# EAGLE design Switching (EAGLE 7.2.0)
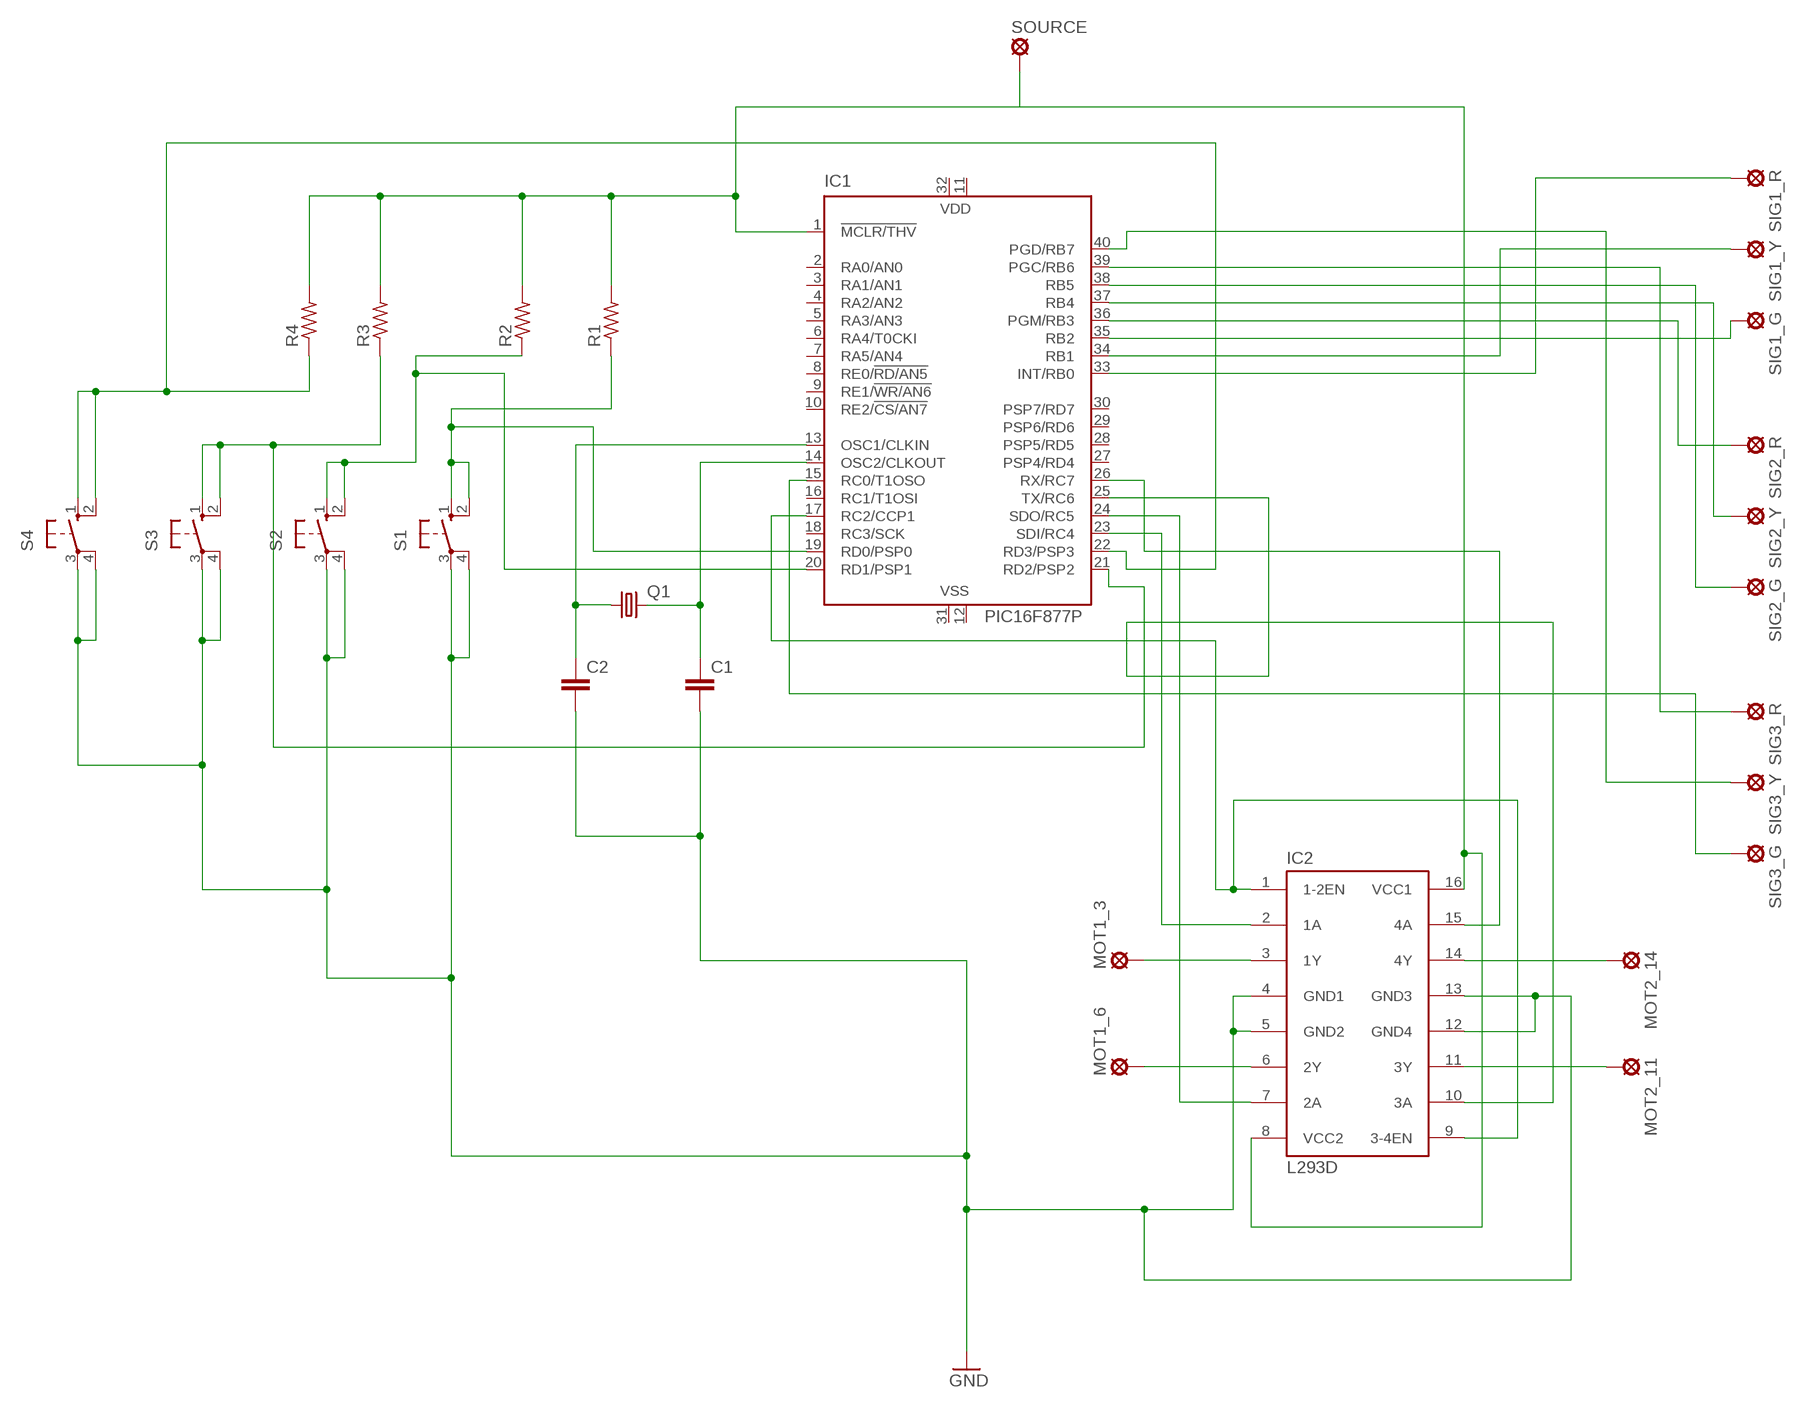
[diagram p0: schematic, sheet 1]

## Parts
C1  C-EU025-025X050  [C025-025X050]
C2  C-EU025-025X050  [C025-025X050]
IC1  PIC16F877P  [DIL40]
IC2  L293D  [DIL16]
MOT1_3  LSP10  [LSP10]
MOT1_6  LSP10  [LSP10]
MOT2_11  LSP10  [LSP10]
MOT2_14  LSP10  [LSP10]
Q1  CRYSTALHC49U70  [HC49U70]
R1  R-US_0207/10  [0207/10]
R2  R-US_0207/10  [0207/10]
R3  R-US_0207/10  [0207/10]
R4  R-US_0207/10  [0207/10]
S1  10-XX  [B3F-10XX]
S2  10-XX  [B3F-10XX]
S3  10-XX  [B3F-10XX]
S4  10-XX  [B3F-10XX]
SIG1_G  LSP10  [LSP10]
SIG1_R  LSP10  [LSP10]
SIG1_Y  LSP10  [LSP10]
SIG2_G  LSP10  [LSP10]
SIG2_R  LSP10  [LSP10]
SIG2_Y  LSP10  [LSP10]
SIG3_G  LSP10  [LSP10]
SIG3_R  LSP10  [LSP10]
SIG3_Y  LSP10  [LSP10]
SOURCE  LSP10  [LSP10]

## Nets
GND: C1.2 C2.2 IC2.4(GND1) IC2.5(GND2) IC2.12(GND4) IC2.13(GND3) S1.3(P) S1.4(P1) S2.3(P) S2.4(P1) S3.3(P) S3.4(P1) S4.3(P) S4.4(P1)
N$1: IC1.33(INT/RB0) SIG1_R.MP
N$2: IC1.34(RB1) SIG1_Y.MP
N$3: IC1.35(RB2) SIG1_G.MP
N$4: IC1.36(PGM/RB3) SIG2_R.MP
N$5: IC1.37(RB4) SIG2_Y.MP
N$6: IC1.38(RB5) SIG2_G.MP
N$7: IC1.39(PGC/RB6) SIG3_R.MP
N$8: IC1.40(PGD/RB7) SIG3_Y.MP
N$9: IC1.15(RC0/T1OSO) SIG3_G.MP
N$10: IC1.17(RC2/CCP1) IC2.1(1-2EN) IC2.9(3-4EN)
N$12: IC1.25(TX/RC6) IC2.10(3A)
N$13: IC1.26(RX/RC7) IC2.15(4A)
N$14: IC1.23(SDI/RC4) IC2.2(1A)
N$15: IC1.24(SDO/RC5) IC2.7(2A)
N$16: IC1.1(!MCLR/THV) IC2.8(VCC2) IC2.16(VCC1) R1.2 R2.2 R3.2 R4.2 SOURCE.MP
N$19: IC2.3(1Y) MOT1_3.MP
N$20: IC2.6(2Y) MOT1_6.MP
N$21: IC2.14(4Y) MOT2_14.MP
N$22: IC2.11(3Y) MOT2_11.MP
N$23: C2.1 IC1.13(OSC1/CLKIN) Q1.1
N$24: C1.1 IC1.14(OSC2/CLKOUT) Q1.2
N$27: IC1.19(RD0/PSP0) R1.1 S1.1(S) S1.2(S1)
N$29: IC1.20(RD1/PSP1) R2.1 S2.1(S) S2.2(S1)
N$30: IC1.21(RD2/PSP2) R3.1 S3.1(S) S3.2(S1)
N$31: IC1.22(RD3/PSP3) R4.1 S4.1(S) S4.2(S1)
Unconnected: IC1.2(RA0/AN0) IC1.3(RA1/AN1) IC1.4(RA2/AN2) IC1.5(RA3/AN3) IC1.6(RA4/T0CKI) IC1.7(RA5/AN4) IC1.8(RE0/!RD/AN5) IC1.9(RE1/!WR/AN6) IC1.10(RE2/!CS/AN7) IC1.16(RC1/T1OSI) IC1.18(RC3/SCK) IC1.27(PSP4/RD4) IC1.28(PSP5/RD5) IC1.29(PSP6/RD6) IC1.30(PSP7/RD7)

## Power pins joined to a net without a drawn wire
VDD: IC1.11(VDD) IC1.32(VDD)
VSS: IC1.12(VSS) IC1.31(VSS)

## Library data of the parts
C1 C2 = rcl:C-EU: CAPACITOR, European symbol
IC1 = microchip:PIC16F87*: MICROCONTROLLER; MF: MICROCHIP; MPN: PIC16F877-04/P; OC_FARNELL: 9761349; OC_NEWARK: 61K3463
IC2 = st-microelectronics:L293D: PUSH-PULL 4 CHANNEL DRIVER; MPN: L293D; OC_FARNELL: 9589619; OC_NEWARK: 56P8249
MOT1_3 MOT1_6 MOT2_11 MOT2_14 SIG1_G SIG1_R SIG1_Y SIG2_G SIG2_R SIG2_Y SIG3_G SIG3_R SIG3_Y SOURCE = solpad:LSP10: SOLDER PAD drill 1.0 mm, distributor Buerklin, 12H555
Q1 = crystal:CRYSTAL: CRYSTAL; OC_FARNELL: unknown; OC_NEWARK: unknown
R1-R4 = rcl:R-US_: RESISTOR, American symbol
S1-S4 = switch-omron:10-XX: OMRON SWITCH; MPN: B3F-1000; OC_FARNELL: 176432; OC_NEWARK: 36M3542

## Board
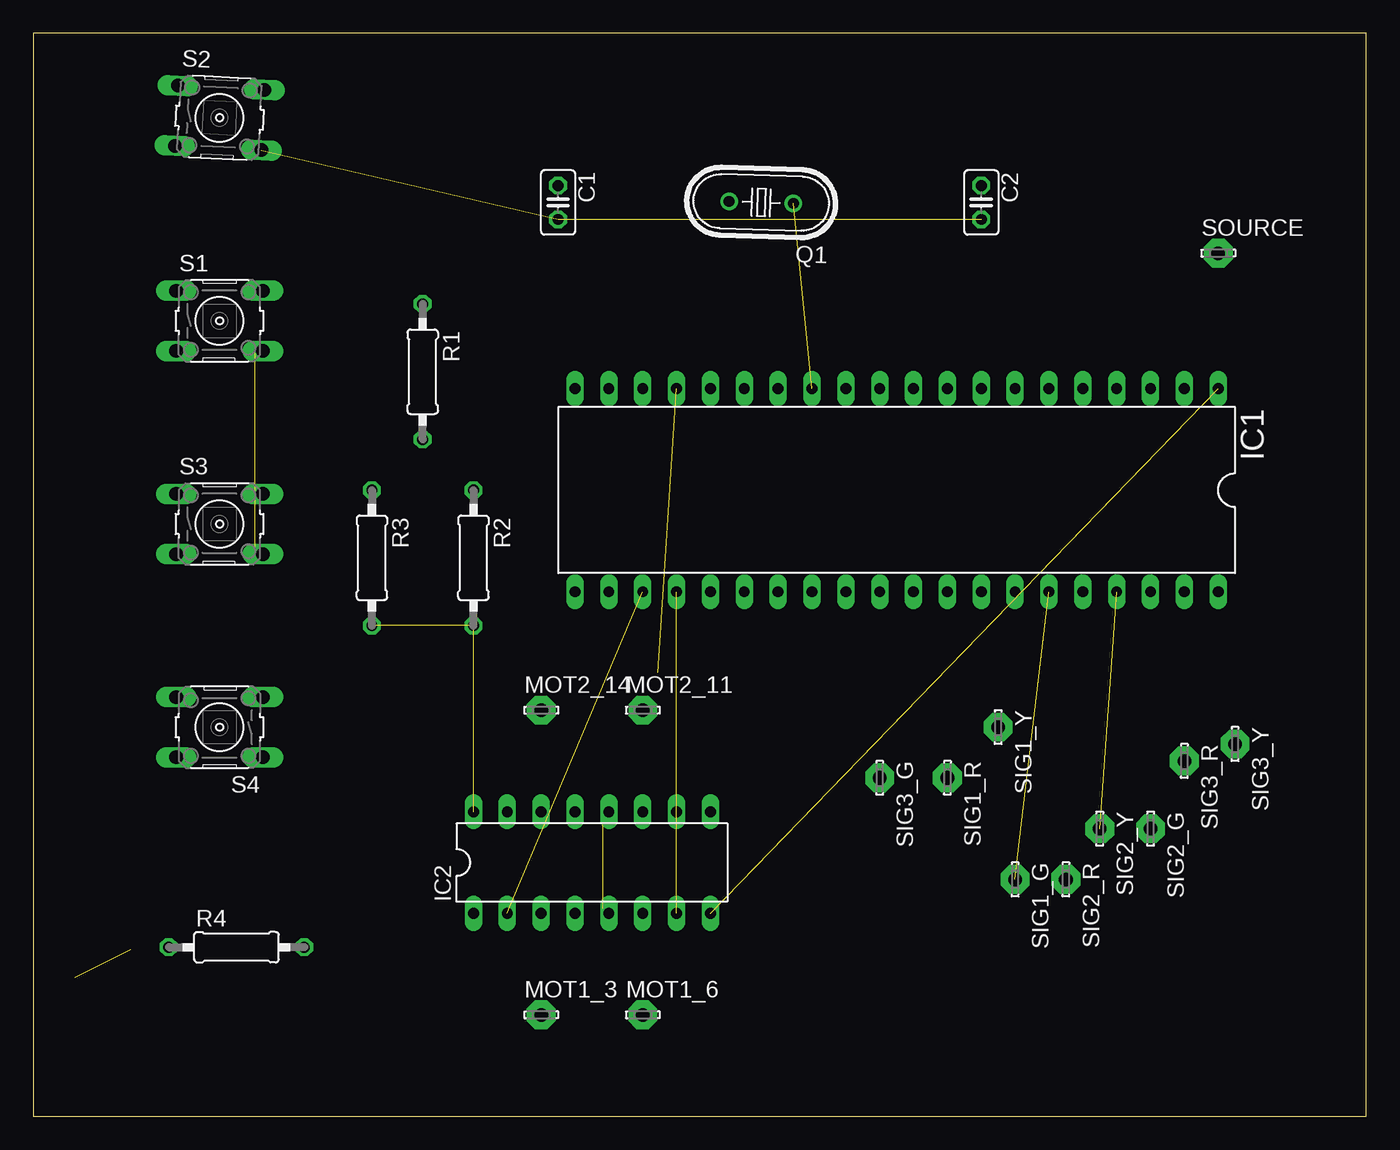
[diagram p1: board, top side]
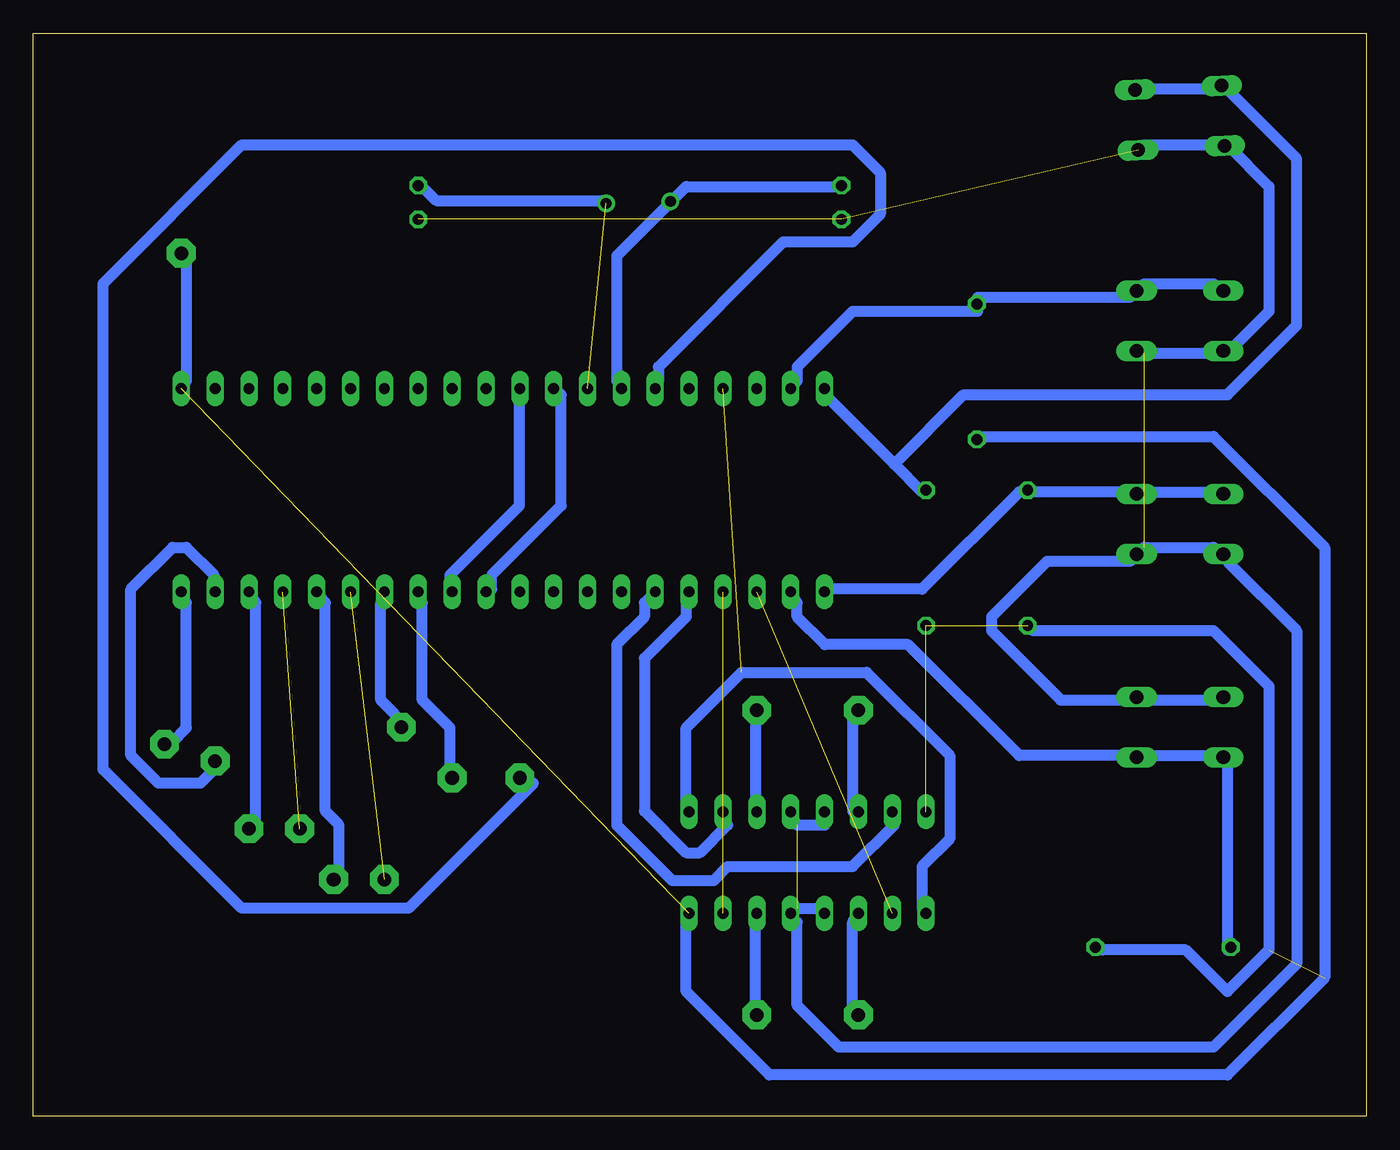
[diagram p2: board, bottom side, seen from below]

Size 100 x 81.27 mm. Coordinates in mm from the lower left corner, seen from the top.
Outline: 0,0 100,0 100,81.27 0,81.27 0,0
Copper layers (1*16): Top 0.035mm / dielectric 1.5mm / Bottom 0.035mm
Design rules "default *": minimum track width 32mil, minimum drill 24mil, track to track 50mil, track to pad 25mil, pad to pad 8mil, via to via 8mil, smd to smd 8mil, copper to edge 40mil, drill to drill 8mil, minimum pad ring 10mil, minimum via ring 8mil, stop-mask expansion 4mil, vias tented up to drill 0mil, thermal gap 10mil

### Footprints (pad centres in the part's own frame; a part is rotated, then mirrored left to right if it is on the bottom)
C025-025X050 = drill 0.813 octagon: 1 -1.27,0; 2 1.27,0
DIL40 = drill 0.813 long: 1 -24.13,-7.62; 2 -21.59,-7.62; 3 -19.05,-7.62; 4 -16.51,-7.62; 5 -13.97,-7.62; 6 -11.43,-7.62; 7 -8.89,-7.62; 8 -6.35,-7.62; 9 -3.81,-7.62; 10 -1.27,-7.62; 11 1.27,-7.62; 12 3.81,-7.62; 13 6.35,-7.62; 14 8.89,-7.62; 15 11.43,-7.62; 16 13.97,-7.62; 17 16.51,-7.62; 18 19.05,-7.62; 19 21.59,-7.62; 20 24.13,-7.62; 21 24.13,7.62; 22 21.59,7.62; 23 19.05,7.62; 24 16.51,7.62; 25 13.97,7.62; 26 11.43,7.62; 27 8.89,7.62; 28 6.35,7.62; 29 3.81,7.62; 30 1.27,7.62; 31 -1.27,7.62; 32 -3.81,7.62; 33 -6.35,7.62; 34 -8.89,7.62; 35 -11.43,7.62; 36 -13.97,7.62; 37 -16.51,7.62; 38 -19.05,7.62; 39 -21.59,7.62; 40 -24.13,7.62
DIL16 = drill 0.813 long: 1 -8.89,-3.81; 2 -6.35,-3.81; 3 -3.81,-3.81; 4 -1.27,-3.81; 5 1.27,-3.81; 6 3.81,-3.81; 7 6.35,-3.81; 8 8.89,-3.81; 9 8.89,3.81; 10 6.35,3.81; 11 3.81,3.81; 12 1.27,3.81; 13 -1.27,3.81; 14 -3.81,3.81; 15 -6.35,3.81; 16 -8.89,3.81
LSP10 = drill 1.016 pad 2.159 octagon: MP 0,0
HC49U70 = drill 0.813: 1 -2.413,0; 2 2.413,0
0207/10 = drill 0.813 octagon: 1 -5.08,0; 2 5.08,0
B3F-10XX = drill 1.016 long: 1 -3.251,2.261; 2 3.251,2.261; 3 -3.251,-2.261; 4 3.251,-2.261

### Placement (x,y rotation side)
C1  39.37,68.58 270 top
C2  71.12,68.58 270 top
IC1  64.77,46.99 180 top
IC2  41.91,19.05 0 top
MOT1_3  38.1,7.62 0 top
MOT1_6  45.72,7.62 0 top
MOT2_11  45.72,30.48 0 top
MOT2_14  38.1,30.48 0 top
Q1  54.61,68.58 178.3 top
R1  29.21,55.88 270 top
R2  33.02,41.91 270 top
R3  25.4,41.91 270 top
R4  15.24,12.7 0 top
S1  13.97,59.69 0 top
S2  13.97,74.93 357.2 top
S3  13.97,44.45 0 top
S4  13.97,29.21 180 top
SIG1_G  73.66,17.78 270 top
SIG1_R  68.58,25.4 270 top
SIG1_Y  72.39,29.21 270 top
SIG2_G  83.82,21.59 270 top
SIG2_R  77.47,17.78 270 top
SIG2_Y  80.01,21.59 270 top
SIG3_G  63.5,25.4 270 top
SIG3_R  86.36,26.67 270 top
SIG3_Y  90.17,27.94 270 top
SOURCE  88.9,64.77 0 top

### Tracks (layer width: path | path; a pad name or v marks a point on that pad's centre or on a via)
GND  (4 unrouted)
  Bottom 0.813: IC2.13 40.62,21.87 42.7,21.87 IC2.12 | S4.4 11.46,31.24 16.66,31.24 S4.3 17.7,31.24 22.91,31.24 28.12,36.45 28.12,37.49 23.95,41.66 17.7,41.66 S3.4 16.66,42.7 11.46,42.7 S3.3 10.41,41.66 5.21,36.45 5.21,11.46 11.46,5.21 39.57,5.21 42.7,8.33 42.7,14.58 IC2.5 42.7,15.62 40.62,15.62 IC2.4 | S1.4 16.66,57.28 11.46,57.28 S1.3 10.41,57.28 7.29,60.4 7.29,69.77 10.41,72.9 S2.3 11.46,72.9 16.66,72.9 S2.4
N$1
  Bottom 0.813: IC1.33 70.81,38.53 70.81,31.24 68.73,29.16 68.73,26.04 SIG1_R.MP
N$2
  Bottom 0.813: IC1.34 73.94,38.53 73.94,31.24 72.9,30.2 SIG1_Y.MP
N$3  (1 unrouted)
N$4
  Bottom 0.813: IC1.36 78.11,38.53 78.11,22.91 77.06,21.87 77.06,18.75 SIG2_R.MP
N$5  (1 unrouted)
N$6
  Bottom 0.813: IC1.38 83.31,38.53 83.31,21.87 SIG2_G.MP
N$7
  Bottom 0.813: IC1.39 86.44,39.57 86.44,40.62 88.52,42.7 89.56,42.7 92.69,39.57 92.69,27.08 90.6,24.99 87.48,24.99 86.44,26.04 SIG3_R.MP
N$8
  Bottom 0.813: IC1.40 88.52,38.53 88.52,29.16 89.56,28.12 SIG3_Y.MP
N$9
  Bottom 0.813: IC1.15 53.11,55.19 53.11,56.24 43.74,65.61 38.53,65.61 36.45,67.69 36.45,70.81 38.53,72.9 84.35,72.9 94.77,62.48 94.77,26.04 84.35,15.62 71.86,15.62 62.48,24.99 SIG3_G.MP
N$10  (1 unrouted)
  Bottom 0.813: IC2.1 33.33,15.62 33.33,18.75 31.24,20.83 31.24,27.08 37.49,33.33 46.86,33.33 51.03,29.16 51.03,22.91 IC2.9
N$12
  Bottom 0.813: IC2.10 47.9,21.87 49.99,19.79 51.03,19.79 54.15,22.91 54.15,34.37 51.03,37.49 51.03,38.53 IC1.25
N$13
  Bottom 0.813: IC2.15 35.41,21.87 38.53,18.75 47.9,18.75 48.95,17.7 52.07,17.7 56.24,21.87 56.24,35.41 54.15,37.49 54.15,38.53 53.11,39.57 IC1.26
N$14  (1 unrouted)
N$15  (1 unrouted)
N$16  (4 unrouted)
  Bottom 0.813: R4.2 19.79,12.5 13.54,12.5 10.41,9.37 7.29,12.5 7.29,32.28 11.46,36.45 24.99,36.45 R3.2 | IC1.1 88.52,55.19 88.52,64.57 SOURCE.MP | IC2.8 51.03,14.58 51.03,9.37 44.78,3.12 10.41,3.12 3.12,10.41 3.12,42.7 11.46,51.03 29.16,51.03 R1.2
N$19
  Bottom 0.813: IC2.3 38.53,14.58 38.53,8.33 MOT1_3.MP
N$20
  Bottom 0.813: IC2.6 45.82,14.58 45.82,8.33 MOT1_6.MP
N$21
  Bottom 0.813: IC2.14 38.53,22.91 38.53,30.2 MOT2_14.MP
N$22
  Bottom 0.813: IC2.11 45.82,22.91 45.82,30.2 MOT2_11.MP
N$23  (1 unrouted)
  Bottom 0.813: Q1.1 57.28,68.73 69.77,68.73 70.81,69.77 C2.1
N$24
  Bottom 0.813: 52.07,68.73 56.24,64.57 56.24,55.19 IC1.14 | 52.07,68.73 51.03,69.77 39.57,69.77 C1.1 | 52.07,68.73 Q1.2
N$27
  Bottom 0.813: IC1.19 42.7,55.19 42.7,56.24 38.53,60.4 29.16,60.4 R1.1 29.16,61.44 17.7,61.44 S1.2 16.66,62.48 11.46,62.48 S1.1
N$29
  Bottom 0.813: S2.2 16.66,77.06 11.46,77.06 S2.1 10.41,77.06 5.21,71.86 5.21,59.36 10.41,54.15 30.2,54.15 35.41,48.95 | 35.41,48.95 40.62,54.15 IC1.20 | 35.41,48.95 33.33,46.86 R2.1
N$30
  Bottom 0.813: IC1.21 40.62,39.57 33.33,39.57 26.04,46.86 R3.1 24.99,46.86 17.7,46.86 S3.2 16.66,46.86 11.46,46.86 S3.1
N$31
  Bottom 0.813: R4.1 10.41,12.5 10.41,27.08 S4.2 11.46,27.08 16.66,27.08 S4.1 17.7,27.08 26.04,27.08 34.37,35.41 40.62,35.41 42.7,37.49 42.7,38.53 IC1.22
VDD
  Bottom 0.813: IC1.11 63.52,54.15 63.52,45.82 68.73,40.62 68.73,39.57 IC1.32
VSS
  Bottom 0.813: IC1.12 60.4,54.15 60.4,45.82 65.61,40.62 65.61,39.57 IC1.31